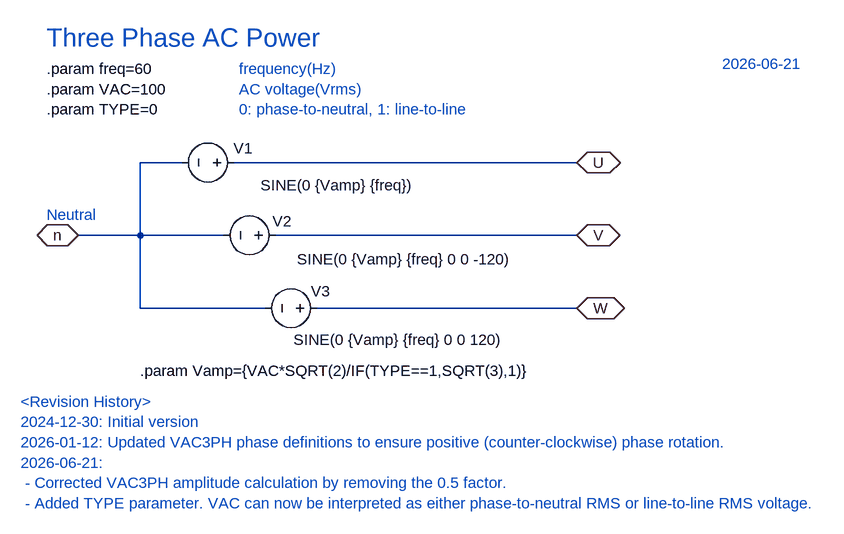
[diagram p0: schematic VAC3PH.asc]
VAC3PH.asc, the LTspice schematic file:
Version 4.1
SHEET 1 1264 876
WIRE 128 112 64 112
WIRE 736 112 208 112
WIRE 64 224 64 112
WIRE 64 224 -32 224
WIRE 192 224 64 224
WIRE 736 224 272 224
WIRE 64 336 64 224
WIRE 256 336 64 336
WIRE 736 336 336 336
FLAG 736 112 U
IOPIN 736 112 BiDir
FLAG -32 224 n
IOPIN -32 224 BiDir
FLAG 736 336 W
IOPIN 736 336 BiDir
FLAG 736 224 V
IOPIN 736 224 BiDir
SYMBOL voltage 224 112 R90
WINDOW 3 35 -262 VRight 2
WINDOW 123 0 0 Left 0
WINDOW 39 0 0 Left 0
WINDOW 0 -22 -13 VRight 2
SYMATTR Value SINE(0 {Vamp} {freq})
SYMATTR InstName V1
SYMBOL voltage 288 224 R90
WINDOW 3 37 -350 VRight 2
WINDOW 123 0 0 Left 0
WINDOW 39 0 0 Left 0
WINDOW 0 -22 -9 VRight 2
SYMATTR Value SINE(0 {Vamp} {freq} 0 0 -120)
SYMATTR InstName V2
SYMBOL voltage 352 336 M270
WINDOW 3 -49 52 VLeft 2
WINDOW 123 0 0 Left 0
WINDOW 39 0 0 Left 0
WINDOW 0 26 25 VLeft 2
SYMATTR Value SINE(0 {Vamp} {freq} 0 0 120)
SYMATTR InstName V3
TEXT -80 -32 Left 2 !.param freq=60\n.param VAC=100\n.param TYPE=0
TEXT -80 -80 Left 4 ;Three Phase AC Power
TEXT -80 192 Left 2 ;Neutral
TEXT 64 432 Left 2 !.param Vamp={VAC*SQRT(2)/IF(TYPE==1,SQRT(3),1)}
TEXT 216 -32 Left 2 ;frequency(Hz)\nAC voltage(Vrms)\n0: phase-to-neutral, 1: line-to-line
TEXT 960 -40 Left 2 ;2026-06-21
TEXT -120 480 Left 2 ;<Revision History>\n2024-12-30: Initial version\n2026-01-12: Updated VAC3PH phase definitions to ensure positive (counter-clockwise) phase rotation.\n2026-06-21: \n - Corrected VAC3PH amplitude calculation by removing the 0.5 factor. \n - Added TYPE parameter. VAC can now be interpreted as either phase-to-neutral RMS or line-to-line RMS voltage.

The netlist it stands for:
* VAC3PH.asc
V1 U n SINE(0 {Vamp} {freq})
V2 V n SINE(0 {Vamp} {freq} 0 0 -120)
V3 W n SINE(0 {Vamp} {freq} 0 0 120)
.param freq=60
.param VAC=100
.param TYPE=0
* Three Phase AC Power
* Neutral
.param Vamp={VAC*SQRT(2)/IF(TYPE==1,SQRT(3),1)}
* frequency(Hz)
* AC voltage(Vrms)
* 0: phase-to-neutral, 1: line-to-line
* 2026-06-21
* <Revision History>
* 2024-12-30: Initial version
* 2026-01-12: Updated VAC3PH phase definitions to ensure positive (counter-clockwise) phase rotation.
* 2026-06-21:
*  - Corrected VAC3PH amplitude calculation by removing the 0.5 factor.
*  - Added TYPE parameter. VAC can now be interpreted as either phase-to-neutral RMS or line-to-line RMS voltage.
.backanno
.end